# Altium project SCB.PrjPCB (part 1 of 6)
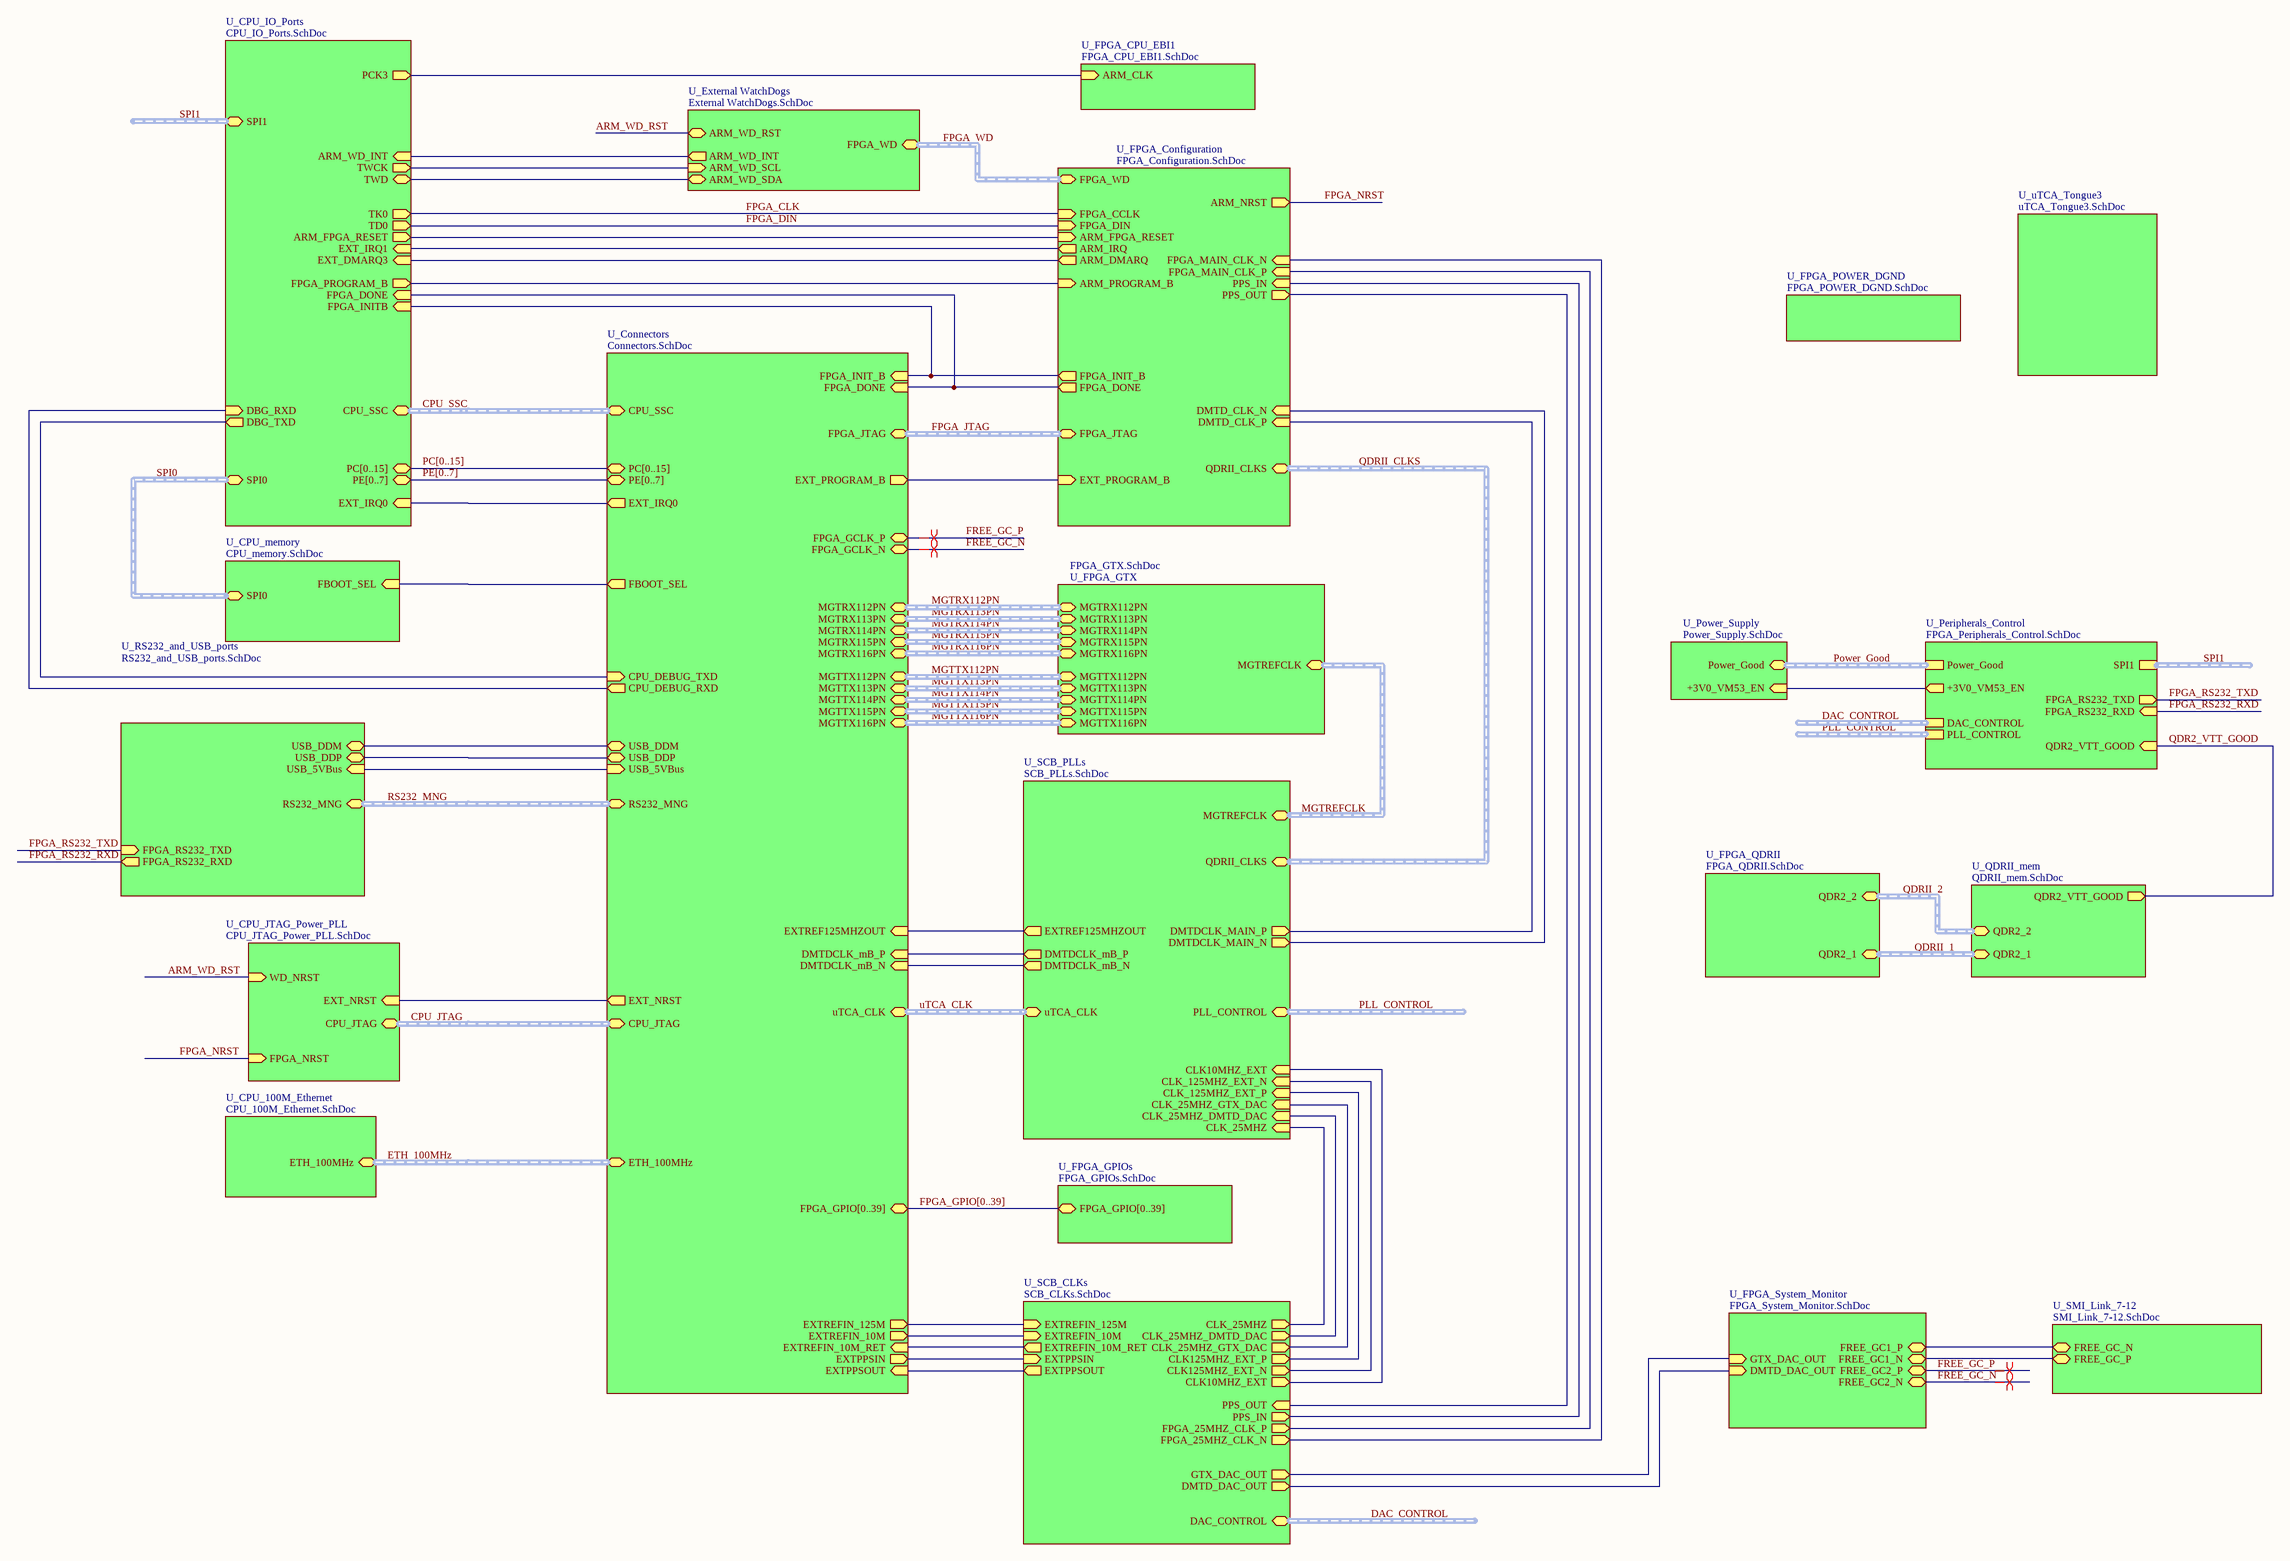
[diagram p0: SCB_MAIN.SchDoc]
23 sheets, 784 parts. Net scope: hierarchical (ports join the sheet entries above them; power ports are global).
Board file: uTCA_MCH_PCB3.pcbdoc
Sheets:
  SCB_MAIN.SchDoc
    U_Connectors = Connectors.SchDoc
    U_CPU_JTAG_Power_PLL = CPU_JTAG_Power_PLL.SchDoc
    U_RS232_and_USB_ports = RS232_and_USB_ports.SchDoc
    U_SCB_CLKs = SCB_CLKs.SchDoc
    U_FPGA_CPU_EBI1 = FPGA_CPU_EBI1.SchDoc
    U_FPGA_GTX = FPGA_GTX.SchDoc
    U_CPU_100M_Ethernet = CPU_100M_Ethernet.SchDoc
    U_CPU_memory = CPU_Memory.SchDoc
    U_SMI_Link_7-12 = SMI_Link_7-12.SchDoc
    U_uTCA_Tongue3 = uTCA_Tongue3.SchDoc
    U_External WatchDogs = External WatchDogs.SchDoc
    U_FPGA_Configuration = FPGA_Configuration.SchDoc
    U_CPU_IO_Ports = CPU_IO_Ports.SchDoc
    U_SCB_PLLs = SCB_PLLs.SchDoc
    U_FPGA_GPIOs = FPGA_GPIOs.SchDoc
    U_FPGA_System_Monitor = FPGA_System_Monitor.SchDoc
    U_Power_Supply = Power_Supply.SchDoc
    U_FPGA_POWER_DGND = FPGA_POWER_DGND.SchDoc
    U_QDRII_mem = QDRII_mem.SchDoc
      U_QDRII_power = QDRII_power.SchDoc
    U_FPGA_QDRII = FPGA_QDRII.SchDoc
    U_Peripherals_Control = FPGA_Peripherals_Control.SchDoc

## Sheet SCB_MAIN.SchDoc
size A2

### Sub-sheets
U_Connectors = Connectors.SchDoc: USB_DDM (bidir), USB_DDP (bidir), USB_5VBus (in), CPU_DEBUG_TXD (in), CPU_DEBUG_RXD (out), EXTPPSIN (out), EXTREFIN_10M (out), EXTREFIN_125M (out), EXTPPSOUT (in), EXTREF125MHZOUT (in), FBOOT_SEL (out), EXT_IRQ0 (out), EXT_NRST (out), FPGA_GCLK_P (bidir), EXT_PROGRAM_B (out), FPGA_DONE (in), FPGA_INIT_B (in), PC[0..15] (bidir), PE[0..7] (bidir), FPGA_GPIO[0..39] (bidir), DMTDCLK_mB_P (in), DMTDCLK_mB_N (in), FPGA_GCLK_N (bidir), MGTTX112PN (harness MGTTX112PN), MGTTX113PN (harness MGTTX113PN), MGTTX114PN (harness MGTTX114PN), MGTTX115PN (harness MGTTX115PN), MGTTX116PN (harness MGTTX116PN), MGTRX112PN (harness MGTRX112PN), MGTRX113PN (harness MGTRX113PN), MGTRX114PN (harness MGTRX114PN), MGTRX115PN (harness MGTRX115PN), MGTRX116PN (harness MGTRX116PN), ETH_100MHz (harness ETH_100MHz), uTCA_CLK (harness uTCA_CLK), CPU_JTAG (harness CPU_JTAG), FPGA_JTAG (harness FPGA_JTAG), CPU_SSC (harness CPU_SSC), RS232_MNG (harness RS232_MNG), EXTREFIN_10M_RET (in)
U_CPU_100M_Ethernet = CPU_100M_Ethernet.SchDoc: ETH_100MHz (harness ETH_100MHz)
U_CPU_IO_Ports = CPU_IO_Ports.SchDoc: EXT_DMARQ3 (in), DBG_TXD (out), DBG_RXD (in), TK0 (out), TD0 (out), PE[0..7] (bidir), PC[0..15] (bidir), EXT_IRQ1 (in), EXT_IRQ0 (in), PCK3 (out), FPGA_DONE (in), FPGA_INITB (in), TWD (bidir), TWCK (out), ARM_WD_INT (in), FPGA_PROGRAM_B (out), CPU_SSC (harness CPU_SSC), SPI0 (harness SPI0), SPI1 (harness SPI1), ARM_FPGA_RESET (out)
U_CPU_JTAG_Power_PLL = CPU_JTAG_Power_PLL.SchDoc: EXT_NRST (in), WD_NRST (in), FPGA_NRST (in), CPU_JTAG (harness CPU_JTAG)
U_CPU_memory = CPU_memory.SchDoc: FBOOT_SEL (in), SPI0 (harness SPI0)
U_External WatchDogs = External WatchDogs.SchDoc: ARM_WD_SCL (in), ARM_WD_SDA (bidir), ARM_WD_INT (out), ARM_WD_RST (bidir), FPGA_WD (harness FPGA_WD)
U_FPGA_Configuration = FPGA_Configuration.SchDoc: FPGA_DONE (out), FPGA_INIT_B (out), ARM_PROGRAM_B (in), FPGA_CCLK (in), FPGA_DIN (in), EXT_PROGRAM_B (in), ARM_NRST (out), ARM_DMARQ (out), ARM_IRQ (out), DMTD_CLK_P (in), DMTD_CLK_N (in), PPS_IN (in), PPS_OUT (out), FPGA_MAIN_CLK_P (in), FPGA_MAIN_CLK_N (in), QDRII_CLKS (harness QDRII_CLKS), FPGA_JTAG (harness FPGA_JTAG), FPGA_WD (harness FPGA_WD), ARM_FPGA_RESET (in)
U_FPGA_CPU_EBI1 = FPGA_CPU_EBI1.SchDoc: ARM_CLK (in)
U_FPGA_GPIOs = FPGA_GPIOs.SchDoc: FPGA_GPIO[0..39] (bidir)
U_FPGA_GTX = FPGA_GTX.SchDoc: MGTREFCLK (harness MGTREFCLK), MGTRX116PN (harness MGTRX116PN), MGTRX115PN (harness MGTRX115PN), MGTRX114PN (harness MGTRX114PN), MGTRX113PN (harness MGTRX113PN), MGTRX112PN (harness MGTRX112PN), MGTTX112PN (harness MGTTX112PN), MGTTX113PN (harness MGTTX113PN), MGTTX114PN (harness MGTTX114PN), MGTTX115PN (harness MGTTX115PN), MGTTX116PN (harness MGTTX116PN)
U_FPGA_POWER_DGND = FPGA_POWER_DGND.SchDoc: no entries
U_FPGA_QDRII = FPGA_QDRII.SchDoc: QDR2_2 (harness qdr2_2_bus), QDR2_1 (harness qdr2_1_bus)
U_FPGA_System_Monitor = FPGA_System_Monitor.SchDoc: DMTD_DAC_OUT (in), GTX_DAC_OUT (in), FREE_GC1_P (bidir), FREE_GC1_N (bidir), FREE_GC2_P (bidir), FREE_GC2_N (bidir)
U_Peripherals_Control = FPGA_Peripherals_Control.SchDoc: SPI1 (harness SPI1), Power_Good (harness Power-Good), DAC_CONTROL (harness DAC_CONTROL), PLL_CONTROL (harness PLL_CONTROL), QDR2_VTT_GOOD (in), +3V0_VM53_EN (out), FPGA_RS232_TXD (out), FPGA_RS232_RXD (in)
U_Power_Supply = Power_Supply.SchDoc: Power_Good (harness Power-Good), +3V0_VM53_EN (in)
U_QDRII_mem = QDRII_mem.SchDoc: QDR2_VTT_GOOD (out), QDR2_1 (harness qdr2_1_bus), QDR2_2 (harness qdr2_2_bus)
U_RS232_and_USB_ports = RS232_and_USB_ports.SchDoc: USB_DDM (bidir), USB_DDP (bidir), USB_5VBus (in), FPGA_RS232_TXD (in), FPGA_RS232_RXD (out), RS232_MNG (harness RS232_MNG)
U_SCB_CLKs = SCB_CLKs.SchDoc: EXTREFIN_10M (in), CLK10MHZ_EXT (out), CLK_25MHZ_GTX_DAC (out), CLK_25MHZ_DMTD_DAC (out), EXTPPSIN (in), EXTPPSOUT (out), EXTREFIN_125M (in), CLK125MHZ_EXT_P (out), CLK125MHZ_EXT_N (out), CLK_25MHZ (out), FPGA_25MHZ_CLK_P (out), FPGA_25MHZ_CLK_N (out), DMTD_DAC_OUT (out), GTX_DAC_OUT (out), PPS_IN (out), PPS_OUT (in), DAC_CONTROL (harness DAC_CONTROL), EXTREFIN_10M_RET (out)
U_SCB_PLLs = SCB_PLLs.SchDoc: CLK_125MHZ_EXT_P (in), CLK_125MHZ_EXT_N (in), CLK_25MHZ_GTX_DAC (in), CLK10MHZ_EXT (in), DMTDCLK_MAIN_P (out), DMTDCLK_MAIN_N (out), CLK_25MHZ_DMTD_DAC (in), EXTREF125MHZOUT (out), CLK_25MHZ (in), DMTDCLK_mB_P (out), DMTDCLK_mB_N (out), PLL_CONTROL (harness PLL_CONTROL), QDRII_CLKS (harness QDRII_CLKS), MGTREFCLK (harness MGTREFCLK), uTCA_CLK (harness uTCA_CLK)
U_SMI_Link_7-12 = SMI_Link_7-12.SchDoc: FREE_GC_P (bidir), FREE_GC_N (bidir)
U_uTCA_Tongue3 = uTCA_Tongue3.SchDoc: no entries

### Nets
+3V0_VM53_EN: sheet U_Power_Supply/+3V0_VM53_EN, sheet U_Peripherals_Control/+3V0_VM53_EN
ARM_DMARQ: sheet U_FPGA_Configuration/ARM_DMARQ, sheet U_CPU_IO_Ports/EXT_DMARQ3
ARM_FPGA_RESET: sheet U_FPGA_Configuration/ARM_FPGA_RESET, sheet U_CPU_IO_Ports/ARM_FPGA_RESET
ARM_IRQ: sheet U_FPGA_Configuration/ARM_IRQ, sheet U_CPU_IO_Ports/EXT_IRQ1
ARM_PROGRAM_B: sheet U_FPGA_Configuration/ARM_PROGRAM_B, sheet U_CPU_IO_Ports/FPGA_PROGRAM_B
ARM_WD_RST: sheet U_CPU_JTAG_Power_PLL/WD_NRST, sheet U_External WatchDogs/ARM_WD_RST
CLK125MHZ_EXT_N: sheet U_SCB_CLKs/CLK125MHZ_EXT_N, sheet U_SCB_PLLs/CLK_125MHZ_EXT_N
CLK125MHZ_EXT_P: sheet U_SCB_CLKs/CLK125MHZ_EXT_P, sheet U_SCB_PLLs/CLK_125MHZ_EXT_P
CLK_25MHz: sheet U_SCB_CLKs/CLK_25MHZ, sheet U_SCB_PLLs/CLK_25MHZ
DMTD_CLK_N: sheet U_FPGA_Configuration/DMTD_CLK_N, sheet U_SCB_PLLs/DMTDCLK_MAIN_N
DMTD_CLK_P: sheet U_FPGA_Configuration/DMTD_CLK_P, sheet U_SCB_PLLs/DMTDCLK_MAIN_P
DMTDCLK_mB_N: sheet U_Connectors/DMTDCLK_mB_N, sheet U_SCB_PLLs/DMTDCLK_mB_N
DMTDCLK_mB_P: sheet U_Connectors/DMTDCLK_mB_P, sheet U_SCB_PLLs/DMTDCLK_mB_P
EXT_PROGRAM_B: sheet U_Connectors/EXT_PROGRAM_B, sheet U_FPGA_Configuration/EXT_PROGRAM_B
FPGA_25MHZ_CLK_N: sheet U_SCB_CLKs/FPGA_25MHZ_CLK_N, sheet U_FPGA_Configuration/FPGA_MAIN_CLK_N
FPGA_25MHZ_CLK_P: sheet U_SCB_CLKs/FPGA_25MHZ_CLK_P, sheet U_FPGA_Configuration/FPGA_MAIN_CLK_P
FPGA_CLK: sheet U_FPGA_Configuration/FPGA_CCLK, sheet U_CPU_IO_Ports/TK0  [project net FPGA_CCLK]
FPGA_DIN: sheet U_FPGA_Configuration/FPGA_DIN, sheet U_CPU_IO_Ports/TD0
FPGA_DONE: sheet U_Connectors/FPGA_DONE, sheet U_FPGA_Configuration/FPGA_DONE, sheet U_CPU_IO_Ports/FPGA_DONE
FPGA_INIT_B: sheet U_Connectors/FPGA_INIT_B, sheet U_FPGA_Configuration/FPGA_INIT_B, sheet U_CPU_IO_Ports/FPGA_INITB
FPGA_NRST: sheet U_CPU_JTAG_Power_PLL/FPGA_NRST, sheet U_FPGA_Configuration/ARM_NRST  [project net ARM_NRST]
FPGA_RS232_RXD: sheet U_RS232_and_USB_ports/FPGA_RS232_RXD, sheet U_Peripherals_Control/FPGA_RS232_RXD
FPGA_RS232_TXD: sheet U_RS232_and_USB_ports/FPGA_RS232_TXD, sheet U_Peripherals_Control/FPGA_RS232_TXD
FREE_GC1_N: sheet U_SMI_Link_7-12/FREE_GC_P, sheet U_FPGA_System_Monitor/FREE_GC1_N
FREE_GC1_P: sheet U_SMI_Link_7-12/FREE_GC_N, sheet U_FPGA_System_Monitor/FREE_GC1_P
FREE_GC_N: sheet U_Connectors/FPGA_GCLK_N, sheet U_FPGA_System_Monitor/FREE_GC2_N  [project net FPGA_GCLK_N]
FREE_GC_P: sheet U_Connectors/FPGA_GCLK_P, sheet U_FPGA_System_Monitor/FREE_GC2_P  [project net FPGA_GCLK_P]
PCK3: sheet U_FPGA_CPU_EBI1/ARM_CLK, sheet U_CPU_IO_Ports/PCK3
PPS_OUT: sheet U_SCB_CLKs/PPS_OUT, sheet U_FPGA_Configuration/PPS_OUT
QDR2_VTT_GOOD: sheet U_QDRII_mem/QDR2_VTT_GOOD, sheet U_Peripherals_Control/QDR2_VTT_GOOD
REF_10M: sheet U_SCB_CLKs/CLK10MHZ_EXT, sheet U_SCB_PLLs/CLK10MHZ_EXT
USB_5VBus: sheet U_Connectors/USB_5VBus, sheet U_RS232_and_USB_ports/USB_5VBus
USB_DDM: sheet U_Connectors/USB_DDM, sheet U_RS232_and_USB_ports/USB_DDM
USB_DDP: sheet U_Connectors/USB_DDP, sheet U_RS232_and_USB_ports/USB_DDP
NetC46_1: sheet U_Connectors/EXTREFIN_125M, sheet U_SCB_CLKs/EXTREFIN_125M
NetC154_2: sheet U_SCB_CLKs/CLK_25MHZ_DMTD_DAC, sheet U_SCB_PLLs/CLK_25MHZ_DMTD_DAC
NetC185_1: sheet U_SCB_CLKs/CLK_25MHZ_GTX_DAC, sheet U_SCB_PLLs/CLK_25MHZ_GTX_DAC
NetD5_2: sheet U_Connectors/EXT_NRST, sheet U_CPU_JTAG_Power_PLL/EXT_NRST
NetIC1#1_A11: sheet U_Connectors/CPU_DEBUG_RXD, sheet U_CPU_IO_Ports/DBG_RXD
NetIC1#1_E10: sheet U_Connectors/CPU_DEBUG_TXD, sheet U_CPU_IO_Ports/DBG_TXD
NetIC1#1_H12: sheet U_External WatchDogs/ARM_WD_INT, sheet U_CPU_IO_Ports/ARM_WD_INT
NetIC1#1_J15: sheet U_External WatchDogs/ARM_WD_SCL, sheet U_CPU_IO_Ports/TWCK
NetIC1#1_K14: sheet U_Connectors/EXT_IRQ0, sheet U_CPU_IO_Ports/EXT_IRQ0
NetIC1#1_L14: sheet U_External WatchDogs/ARM_WD_SDA, sheet U_CPU_IO_Ports/TWD
NetIC5_3: sheet U_SCB_CLKs/GTX_DAC_OUT, sheet U_FPGA_System_Monitor/GTX_DAC_OUT
NetIC8_3: sheet U_SCB_CLKs/DMTD_DAC_OUT, sheet U_FPGA_System_Monitor/DMTD_DAC_OUT
NetIC12_2: sheet U_Connectors/EXTPPSIN, sheet U_SCB_CLKs/EXTPPSIN
NetIC26_1: sheet U_Connectors/FBOOT_SEL, sheet U_CPU_memory/FBOOT_SEL
NetIC33_J25: sheet U_SCB_CLKs/PPS_IN, sheet U_FPGA_Configuration/PPS_IN
NetP1_1: sheet U_Connectors/EXTREF125MHZOUT, sheet U_SCB_PLLs/EXTREF125MHZOUT
NetP3_1: sheet U_Connectors/EXTPPSOUT, sheet U_SCB_CLKs/EXTPPSOUT
NetP7_1: sheet U_Connectors/EXTREFIN_10M, sheet U_SCB_CLKs/EXTREFIN_10M
NetP7_2: sheet U_Connectors/EXTREFIN_10M_RET, sheet U_SCB_CLKs/EXTREFIN_10M_RET

### Buses and harness runs
bus FPGA_GPIO[0..39] = sheet U_Connectors/FPGA_GPIO[0..39] = sheet U_FPGA_GPIOs/FPGA_GPIO[0..39]
bus PC[0..15] = sheet U_Connectors/PC[0..15] = sheet U_CPU_IO_Ports/PC[0..15]
bus PE[0..7] = sheet U_Connectors/PE[0..7] = sheet U_CPU_IO_Ports/PE[0..7]
harness CPU_JTAG = sheet U_Connectors/CPU_JTAG = sheet U_CPU_JTAG_Power_PLL/CPU_JTAG
harness CPU_SSC = sheet U_Connectors/CPU_SSC = sheet U_CPU_IO_Ports/CPU_SSC
harness DAC_CONTROL = sheet U_Peripherals_Control/DAC_CONTROL
harness DAC_CONTROL = sheet U_SCB_CLKs/DAC_CONTROL
harness ETH_100MHz = sheet U_Connectors/ETH_100MHz = sheet U_CPU_100M_Ethernet/ETH_100MHz
harness FPGA_JTAG = sheet U_Connectors/FPGA_JTAG = sheet U_FPGA_Configuration/FPGA_JTAG
harness FPGA_WD = sheet U_External WatchDogs/FPGA_WD = sheet U_FPGA_Configuration/FPGA_WD
harness MGTREFCLK = sheet U_FPGA_GTX/MGTREFCLK = sheet U_SCB_PLLs/MGTREFCLK
harness MGTRX112PN = sheet U_Connectors/MGTRX112PN = sheet U_FPGA_GTX/MGTRX112PN
harness MGTRX113PN = sheet U_Connectors/MGTRX113PN = sheet U_FPGA_GTX/MGTRX113PN
harness MGTRX114PN = sheet U_Connectors/MGTRX114PN = sheet U_FPGA_GTX/MGTRX114PN
harness MGTRX115PN = sheet U_Connectors/MGTRX115PN = sheet U_FPGA_GTX/MGTRX115PN
harness MGTRX116PN = sheet U_Connectors/MGTRX116PN = sheet U_FPGA_GTX/MGTRX116PN
harness MGTTX112PN = sheet U_Connectors/MGTTX112PN = sheet U_FPGA_GTX/MGTTX112PN
harness MGTTX113PN = sheet U_Connectors/MGTTX113PN = sheet U_FPGA_GTX/MGTTX113PN
harness MGTTX114PN = sheet U_Connectors/MGTTX114PN = sheet U_FPGA_GTX/MGTTX114PN
harness MGTTX115PN = sheet U_Connectors/MGTTX115PN = sheet U_FPGA_GTX/MGTTX115PN
harness MGTTX116PN = sheet U_Connectors/MGTTX116PN = sheet U_FPGA_GTX/MGTTX116PN
harness PLL_CONTROL = sheet U_Peripherals_Control/PLL_CONTROL
harness PLL_CONTROL = sheet U_SCB_PLLs/PLL_CONTROL
harness Power_Good = sheet U_Peripherals_Control/Power_Good = sheet U_Power_Supply/Power_Good
harness QDRII_1 = sheet U_FPGA_QDRII/QDR2_1 = sheet U_QDRII_mem/QDR2_1
harness QDRII_2 = sheet U_FPGA_QDRII/QDR2_2 = sheet U_QDRII_mem/QDR2_2
harness QDRII_CLKS = sheet U_FPGA_Configuration/QDRII_CLKS = sheet U_SCB_PLLs/QDRII_CLKS
harness RS232_MNG = sheet U_Connectors/RS232_MNG = sheet U_RS232_and_USB_ports/RS232_MNG
harness SPI0 = sheet U_CPU_IO_Ports/SPI0 = sheet U_CPU_memory/SPI0
harness SPI1 = sheet U_CPU_IO_Ports/SPI1
harness SPI1 = sheet U_Peripherals_Control/SPI1
harness uTCA_CLK = sheet U_Connectors/uTCA_CLK = sheet U_SCB_PLLs/uTCA_CLK

### Layout directives
differential pair: FPGA_GCLK_N, FPGA_GCLK_P

## Sheet Connectors.SchDoc
size A3
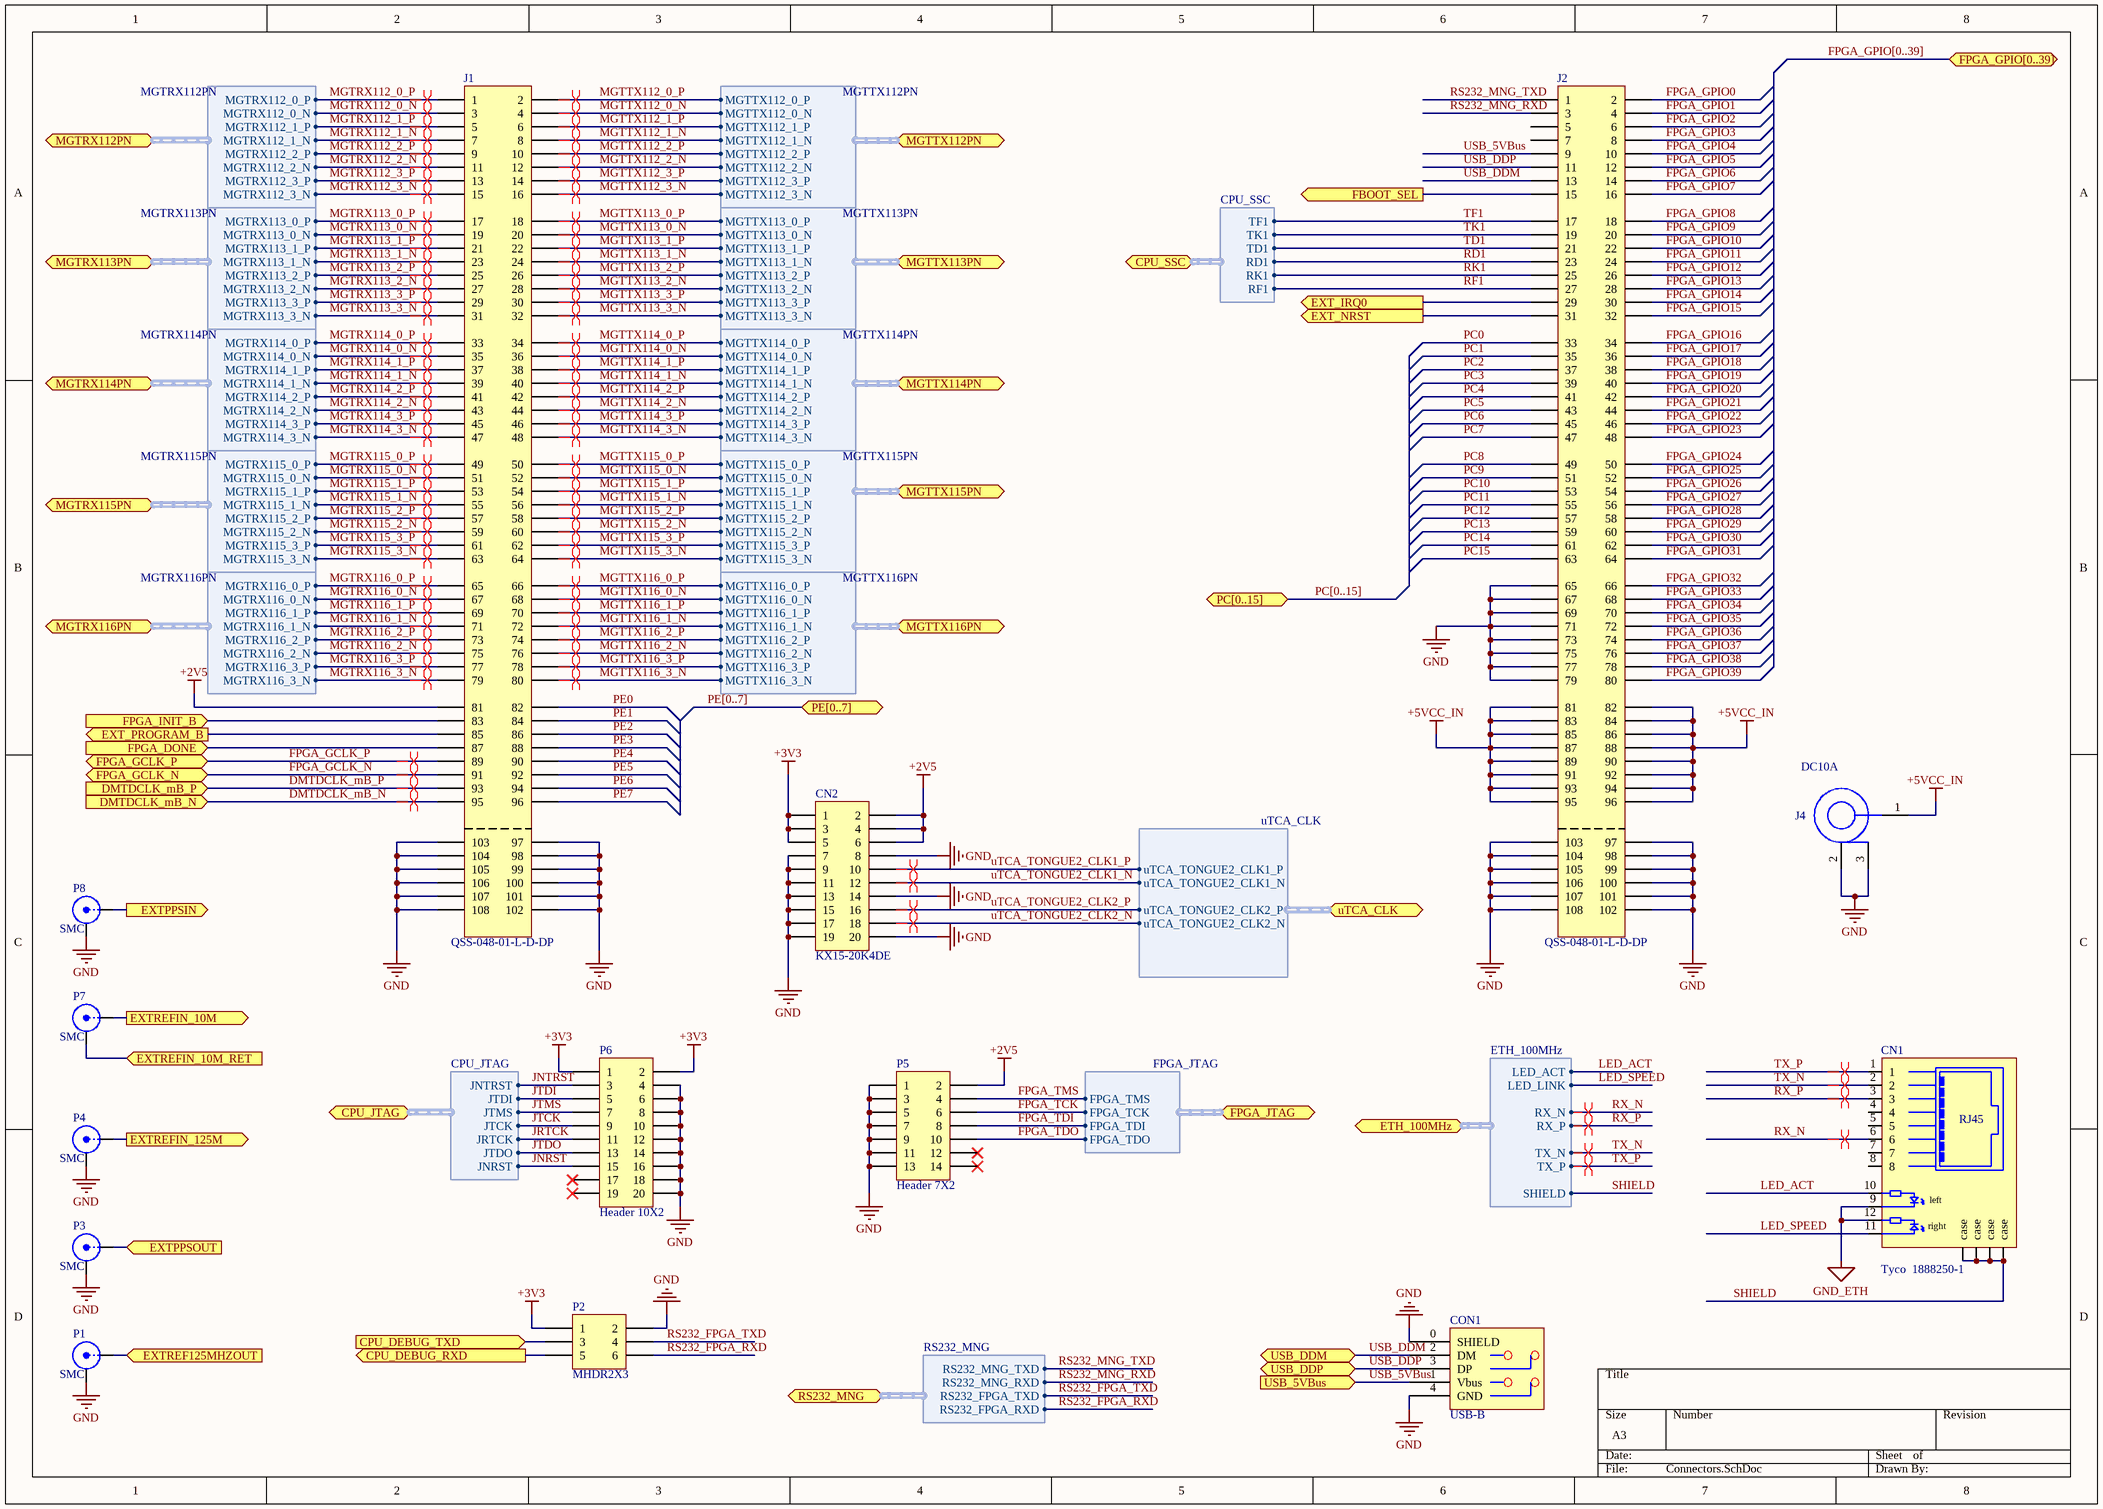
[diagram p1: Connectors.SchDoc]

### Parts
CN1  Tyco  1888250-1  [TYCO_ETHERNET_1888250-1]
CN2  KX15-20K4DE  [JAE_KX15_20P]
CON1  USB-B  [USBB-G]
J1  QSS-048-01-L-D-DP  [QSS-048-01-X-D-DP-A]
J2  QSS-048-01-L-D-DP  [QSS-048-01-X-D-DP-A]
J4  DC10A  [dc-10]
P1  SMC  [SMB_V-RJ45]
P2  MHDR2X3  [HDR2X3]
P3  SMC  [SMB_V-RJ45]
P4  SMC  [SMB_V-RJ45]
P5  Header 7X2  [CONN_HDR_SMD_2mm_2x7]
P6  Header 10X2  [HDR2X10]
P7  SMC  [SMB_V-RJ45]
P8  SMC  [SMB_V-RJ45]

### Ports
CPU_DEBUG_RXD (out), CPU_DEBUG_TXD (in), CPU_JTAG (harness CPU_JTAG), CPU_SSC (harness CPU_SSC), DMTDCLK_mB_N (in), DMTDCLK_mB_P (in), ETH_100MHz (harness ETH_100MHz), EXT_IRQ0 (out), EXT_NRST (out), EXT_PROGRAM_B (out), EXTPPSIN (out), EXTPPSOUT (in), EXTREF125MHZOUT (in), EXTREFIN_10M (out), EXTREFIN_10M_RET (in), EXTREFIN_125M (out), FBOOT_SEL (out), FPGA_DONE (in), FPGA_GCLK_N (bidir), FPGA_GCLK_P (bidir), FPGA_GPIO[0..39] (bidir), FPGA_INIT_B (in), FPGA_JTAG (harness FPGA_JTAG), MGTRX112PN (harness MGTRX112PN), MGTRX113PN (harness MGTRX113PN), MGTRX114PN (harness MGTRX114PN), MGTRX115PN (harness MGTRX115PN), MGTRX116PN (harness MGTRX116PN), MGTTX112PN (harness MGTTX112PN), MGTTX113PN (harness MGTTX113PN), MGTTX114PN (harness MGTTX114PN), MGTTX115PN (harness MGTTX115PN), MGTTX116PN (harness MGTTX116PN), PC[0..15] (bidir), PE[0..7] (bidir), RS232_MNG (harness RS232_MNG), USB_5VBus (in), USB_DDM (bidir), USB_DDP (bidir), uTCA_CLK (harness uTCA_CLK)

### Harnesses
MGTTX112PN: MGTTX112_0_P, MGTTX112_0_N, MGTTX112_1_P, MGTTX112_1_N, MGTTX112_2_P, MGTTX112_2_N, MGTTX112_3_P, MGTTX112_3_N
MGTTX113PN: MGTTX113_0_P, MGTTX113_0_N, MGTTX113_1_P, MGTTX113_1_N, MGTTX113_2_P, MGTTX113_2_N, MGTTX113_3_P, MGTTX113_3_N
MGTTX114PN: MGTTX114_0_P, MGTTX114_0_N, MGTTX114_1_P, MGTTX114_1_N, MGTTX114_2_P, MGTTX114_2_N, MGTTX114_3_P, MGTTX114_3_N
MGTTX115PN: MGTTX115_0_P, MGTTX115_0_N, MGTTX115_1_P, MGTTX115_1_N, MGTTX115_2_P, MGTTX115_2_N, MGTTX115_3_P, MGTTX115_3_N
MGTTX116PN: MGTTX116_0_P, MGTTX116_0_N, MGTTX116_1_P, MGTTX116_1_N, MGTTX116_2_P, MGTTX116_2_N, MGTTX116_3_P, MGTTX116_3_N
MGTRX112PN: MGTRX112_0_P, MGTRX112_0_N, MGTRX112_1_P, MGTRX112_1_N, MGTRX112_2_P, MGTRX112_2_N, MGTRX112_3_P, MGTRX112_3_N
MGTRX113PN: MGTRX113_0_P, MGTRX113_0_N, MGTRX113_1_P, MGTRX113_1_N, MGTRX113_2_P, MGTRX113_2_N, MGTRX113_3_P, MGTRX113_3_N
MGTRX114PN: MGTRX114_0_P, MGTRX114_0_N, MGTRX114_1_P, MGTRX114_1_N, MGTRX114_2_P, MGTRX114_2_N, MGTRX114_3_P, MGTRX114_3_N
MGTRX115PN: MGTRX115_0_P, MGTRX115_0_N, MGTRX115_1_P, MGTRX115_1_N, MGTRX115_2_P, MGTRX115_2_N, MGTRX115_3_P, MGTRX115_3_N
MGTRX116PN: MGTRX116_0_P, MGTRX116_0_N, MGTRX116_1_P, MGTRX116_1_N, MGTRX116_2_P, MGTRX116_2_N, MGTRX116_3_P, MGTRX116_3_N
ETH_100MHz: SHIELD, RX_P, TX_P, TX_N, RX_N, LED_LINK, LED_ACT
uTCA_CLK: uTCA_TONGUE2_CLK1_P, uTCA_TONGUE2_CLK1_N, uTCA_TONGUE2_CLK2_P, uTCA_TONGUE2_CLK2_N
CPU_JTAG: JNRST, JTDO, JRTCK, JTCK, JTMS, JTDI, JNTRST
FPGA_JTAG: FPGA_TMS, FPGA_TCK, FPGA_TDI, FPGA_TDO
CPU_SSC: TF1, TK1, TD1, RD1, RK1, RF1
RS232_MNG: RS232_MNG_TXD, RS232_FPGA_TXD, RS232_MNG_RXD, RS232_FPGA_RXD

### Nets
+2V5: CN2.2 CN2.4 CN2.6 J1.81 P5.2
+3V3: CN2.1 CN2.3 CN2.5 P2.1 P6.1 P6.2
+5VCC_IN: J2.81 J2.82 J2.83 J2.84 J2.85 J2.86 J2.87 J2.88 J2.89 J2.90 J2.91 J2.92 J2.93 J2.94 J2.95 J2.96 J4.1(P1)
GND: CN2.7 CN2.8 CN2.9 CN2.11 CN2.13 CN2.14 CN2.15 CN2.17 CN2.19 CN2.20 CON1.0(SHIELD) CON1.4(GND) J1.97 J1.98 J1.99 J1.100 J1.101 J1.102 J1.103 J1.104 J1.105 J1.106 J1.107 J1.108 J2.65 J2.67 J2.69 J2.71 J2.73 J2.75 J2.77 J2.79 J2.97 J2.98 J2.99 J2.100 J2.101 J2.102 J2.103 J2.104 J2.105 J2.106 J2.107 J2.108 J4.2(P2) J4.3(P3) P1.2(Y) P2.2 P3.2(Y) P4.2(Y) P5.1 P5.3 P5.5 P5.7 P5.9 P5.11 P5.13 P6.4 P6.6 P6.8 P6.10 P6.12 P6.14 P6.16 P6.18 P6.20 P8.2(Y)
GND_ETH: CN1.9(D2) CN1.12(D3)
DMTDCLK_mB_N: J1.95 ; port DMTDCLK_mB_N
DMTDCLK_mB_P: J1.93 ; port DMTDCLK_mB_P
EXT_PROGRAM_B: J1.85 ; port EXT_PROGRAM_B
FPGA_DONE: J1.87 ; port FPGA_DONE
FPGA_GCLK_N: J1.91 ; port FPGA_GCLK_N
FPGA_GCLK_P: J1.89 ; port FPGA_GCLK_P
FPGA_GPIO0: J2.2
FPGA_GPIO1: J2.4
FPGA_GPIO2: J2.6
FPGA_GPIO3: J2.8
FPGA_GPIO4: J2.10
FPGA_GPIO5: J2.12
FPGA_GPIO6: J2.14
FPGA_GPIO7: J2.16
FPGA_GPIO8: J2.18
FPGA_GPIO9: J2.20
FPGA_GPIO10: J2.22
FPGA_GPIO11: J2.24
FPGA_GPIO12: J2.26
FPGA_GPIO13: J2.28
FPGA_GPIO14: J2.30
FPGA_GPIO15: J2.32
FPGA_GPIO16: J2.34
FPGA_GPIO17: J2.36
FPGA_GPIO18: J2.38
FPGA_GPIO19: J2.40
FPGA_GPIO20: J2.42
FPGA_GPIO21: J2.44
FPGA_GPIO22: J2.46
FPGA_GPIO23: J2.48
FPGA_GPIO24: J2.50
FPGA_GPIO25: J2.52
FPGA_GPIO26: J2.54
FPGA_GPIO27: J2.56
FPGA_GPIO28: J2.58
FPGA_GPIO29: J2.60
FPGA_GPIO30: J2.62
FPGA_GPIO31: J2.64
FPGA_GPIO32: J2.66
FPGA_GPIO33: J2.68
FPGA_GPIO34: J2.70
FPGA_GPIO35: J2.72
FPGA_GPIO36: J2.74
FPGA_GPIO37: J2.76
FPGA_GPIO38: J2.78
FPGA_GPIO39: J2.80
FPGA_INIT_B: J1.83 ; port FPGA_INIT_B
FPGA_TCK: P5.6 ; port FPGA_JTAG.FPGA_TCK  [project net FPGA_JTAG.FPGA_TCK]
FPGA_TDI: P5.8 ; port FPGA_JTAG.FPGA_TDI  [project net FPGA_JTAG.FPGA_TDI]
FPGA_TDO: P5.10 ; port FPGA_JTAG.FPGA_TDO  [project net FPGA_JTAG.FPGA_TDO]
FPGA_TMS: P5.4 ; port FPGA_JTAG.FPGA_TMS  [project net FPGA_JTAG.FPGA_TMS]
JNRST: P6.15 ; port CPU_JTAG.JNRST  [project net CPU_JTAG.JNRST]
JNTRST: P6.3 ; port CPU_JTAG.JNTRST  [project net CPU_JTAG.JNTRST]
JRTCK: P6.11 ; port CPU_JTAG.JRTCK  [project net CPU_JTAG.JRTCK]
JTCK: P6.9 ; port CPU_JTAG.JTCK  [project net CPU_JTAG.JTCK]
JTDI: P6.5 ; port CPU_JTAG.JTDI  [project net CPU_JTAG.JTDI]
JTDO: P6.13 ; port CPU_JTAG.JTDO  [project net CPU_JTAG.JTDO]
JTMS: P6.7 ; port CPU_JTAG.JTMS  [project net CPU_JTAG.JTMS]
LED_ACT: CN1.10(D1) ; port ETH_100MHz.LED_ACT  [project net ETH_100MHz.LED_ACT]
LED_SPEED: CN1.11(D4) ; port ETH_100MHz.LED_LINK  [project net ETH_100MHz.LED_LINK]
MGTRX112_0_N: J1.3 ; port MGTRX112PN.MGTRX112_0_N
MGTRX112_0_P: J1.1 ; port MGTRX112PN.MGTRX112_0_P
MGTRX112_1_N: J1.7 ; port MGTRX112PN.MGTRX112_1_N
MGTRX112_1_P: J1.5 ; port MGTRX112PN.MGTRX112_1_P
MGTRX112_2_N: J1.11 ; port MGTRX112PN.MGTRX112_2_N
MGTRX112_2_P: J1.9 ; port MGTRX112PN.MGTRX112_2_P
MGTRX112_3_N: J1.15 ; port MGTRX112PN.MGTRX112_3_N
MGTRX112_3_P: J1.13 ; port MGTRX112PN.MGTRX112_3_P
MGTRX113_0_N: J1.19 ; port MGTRX113PN.MGTRX113_0_N
MGTRX113_0_P: J1.17 ; port MGTRX113PN.MGTRX113_0_P
MGTRX113_1_N: J1.23 ; port MGTRX113PN.MGTRX113_1_N
MGTRX113_1_P: J1.21 ; port MGTRX113PN.MGTRX113_1_P
MGTRX113_2_N: J1.27 ; port MGTRX113PN.MGTRX113_2_N
MGTRX113_2_P: J1.25 ; port MGTRX113PN.MGTRX113_2_P
MGTRX113_3_N: J1.31 ; port MGTRX113PN.MGTRX113_3_N
MGTRX113_3_P: J1.29 ; port MGTRX113PN.MGTRX113_3_P
MGTRX114_0_N: J1.35 ; port MGTRX114PN.MGTRX114_0_N
MGTRX114_0_P: J1.33 ; port MGTRX114PN.MGTRX114_0_P
MGTRX114_1_N: J1.39 ; port MGTRX114PN.MGTRX114_1_N
MGTRX114_1_P: J1.37 ; port MGTRX114PN.MGTRX114_1_P
MGTRX114_2_N: J1.43 ; port MGTRX114PN.MGTRX114_2_N
MGTRX114_2_P: J1.41 ; port MGTRX114PN.MGTRX114_2_P
MGTRX114_3_N: J1.47 ; port MGTRX114PN.MGTRX114_3_N
MGTRX114_3_P: J1.45 ; port MGTRX114PN.MGTRX114_3_P
MGTRX115_0_N: J1.51 ; port MGTRX115PN.MGTRX115_0_N
MGTRX115_0_P: J1.49 ; port MGTRX115PN.MGTRX115_0_P
MGTRX115_1_N: J1.55 ; port MGTRX115PN.MGTRX115_1_N
MGTRX115_1_P: J1.53 ; port MGTRX115PN.MGTRX115_1_P
MGTRX115_2_N: J1.59 ; port MGTRX115PN.MGTRX115_2_N
MGTRX115_2_P: J1.57 ; port MGTRX115PN.MGTRX115_2_P
MGTRX115_3_N: J1.63 ; port MGTRX115PN.MGTRX115_3_N
MGTRX115_3_P: J1.61 ; port MGTRX115PN.MGTRX115_3_P
MGTRX116_0_N: J1.67 ; port MGTRX116PN.MGTRX116_0_N
MGTRX116_0_P: J1.65 ; port MGTRX116PN.MGTRX116_0_P
MGTRX116_1_N: J1.71 ; port MGTRX116PN.MGTRX116_1_N
MGTRX116_1_P: J1.69 ; port MGTRX116PN.MGTRX116_1_P
MGTRX116_2_N: J1.75 ; port MGTRX116PN.MGTRX116_2_N
MGTRX116_2_P: J1.73 ; port MGTRX116PN.MGTRX116_2_P
MGTRX116_3_N: J1.79 ; port MGTRX116PN.MGTRX116_3_N
MGTRX116_3_P: J1.77 ; port MGTRX116PN.MGTRX116_3_P
MGTTX112_0_N: J1.4 ; port MGTTX112PN.MGTTX112_0_N
MGTTX112_0_P: J1.2 ; port MGTTX112PN.MGTTX112_0_P
MGTTX112_1_N: J1.8 ; port MGTTX112PN.MGTTX112_1_N
MGTTX112_1_P: J1.6 ; port MGTTX112PN.MGTTX112_1_P
MGTTX112_2_N: J1.12 ; port MGTTX112PN.MGTTX112_2_N
MGTTX112_2_P: J1.10 ; port MGTTX112PN.MGTTX112_2_P
MGTTX112_3_N: J1.16 ; port MGTTX112PN.MGTTX112_3_N
MGTTX112_3_P: J1.14 ; port MGTTX112PN.MGTTX112_3_P
MGTTX113_0_N: J1.20 ; port MGTTX113PN.MGTTX113_0_N
MGTTX113_0_P: J1.18 ; port MGTTX113PN.MGTTX113_0_P
MGTTX113_1_N: J1.24 ; port MGTTX113PN.MGTTX113_1_N
MGTTX113_1_P: J1.22 ; port MGTTX113PN.MGTTX113_1_P
MGTTX113_2_N: J1.28 ; port MGTTX113PN.MGTTX113_2_N
MGTTX113_2_P: J1.26 ; port MGTTX113PN.MGTTX113_2_P
MGTTX113_3_N: J1.32 ; port MGTTX113PN.MGTTX113_3_N
MGTTX113_3_P: J1.30 ; port MGTTX113PN.MGTTX113_3_P
MGTTX114_0_N: J1.36 ; port MGTTX114PN.MGTTX114_0_N
MGTTX114_0_P: J1.34 ; port MGTTX114PN.MGTTX114_0_P
MGTTX114_1_N: J1.40 ; port MGTTX114PN.MGTTX114_1_N
MGTTX114_1_P: J1.38 ; port MGTTX114PN.MGTTX114_1_P
MGTTX114_2_N: J1.44 ; port MGTTX114PN.MGTTX114_2_N
MGTTX114_2_P: J1.42 ; port MGTTX114PN.MGTTX114_2_P
MGTTX114_3_N: J1.48 ; port MGTTX114PN.MGTTX114_3_N
MGTTX114_3_P: J1.46 ; port MGTTX114PN.MGTTX114_3_P
MGTTX115_0_N: J1.52 ; port MGTTX115PN.MGTTX115_0_N
MGTTX115_0_P: J1.50 ; port MGTTX115PN.MGTTX115_0_P
MGTTX115_1_N: J1.56 ; port MGTTX115PN.MGTTX115_1_N
MGTTX115_1_P: J1.54 ; port MGTTX115PN.MGTTX115_1_P
MGTTX115_2_N: J1.60 ; port MGTTX115PN.MGTTX115_2_N
MGTTX115_2_P: J1.58 ; port MGTTX115PN.MGTTX115_2_P
MGTTX115_3_N: J1.64 ; port MGTTX115PN.MGTTX115_3_N
MGTTX115_3_P: J1.62 ; port MGTTX115PN.MGTTX115_3_P
MGTTX116_0_N: J1.68 ; port MGTTX116PN.MGTTX116_0_N
MGTTX116_0_P: J1.66 ; port MGTTX116PN.MGTTX116_0_P
MGTTX116_1_N: J1.72 ; port MGTTX116PN.MGTTX116_1_N
MGTTX116_1_P: J1.70 ; port MGTTX116PN.MGTTX116_1_P
MGTTX116_2_N: J1.76 ; port MGTTX116PN.MGTTX116_2_N
MGTTX116_2_P: J1.74 ; port MGTTX116PN.MGTTX116_2_P
MGTTX116_3_N: J1.80 ; port MGTTX116PN.MGTTX116_3_N
MGTTX116_3_P: J1.78 ; port MGTTX116PN.MGTTX116_3_P
PC0: J2.33
PC1: J2.35
PC2: J2.37
PC3: J2.39
PC4: J2.41
PC5: J2.43
PC6: J2.45
PC7: J2.47
PC8: J2.49
PC9: J2.51
PC10: J2.53
PC11: J2.55
PC12: J2.57
PC13: J2.59
PC14: J2.61
PC15: J2.63
PE0: J1.82
PE1: J1.84
PE2: J1.86
PE3: J1.88
PE4: J1.90
PE5: J1.92
PE6: J1.94
PE7: J1.96
RD1: J2.23 ; port CPU_SSC.RD1  [project net CPU_SSC.RD1]
RF1: J2.27 ; port CPU_SSC.RF1  [project net CPU_SSC.RF1]
RK1: J2.25 ; port CPU_SSC.RK1  [project net CPU_SSC.RK1]
RS232_FPGA_RXD: P2.6 ; port RS232_MNG.RS232_FPGA_RXD
RS232_FPGA_TXD: P2.4 ; port RS232_MNG.RS232_FPGA_TXD
RS232_MNG_RXD: J2.3 ; port RS232_MNG.RS232_MNG_RXD  [project net RS232_MNG.RS232_MNG_RXD]
RS232_MNG_TXD: J2.1 ; port RS232_MNG.RS232_MNG_TXD  [project net RS232_MNG.RS232_MNG_TXD]
RX_N: CN1.6 ; port ETH_100MHz.RX_N  [project net ETH_100MHz.RX_N]
RX_P: CN1.3 ; port ETH_100MHz.RX_P  [project net ETH_100MHz.RX_P]
SHIELD: CN1.0(case) ; port ETH_100MHz.SHIELD  [project net ETH_100MHz.SHIELD]
TD1: J2.21 ; port CPU_SSC.TD1  [project net CPU_SSC.TD1]
TF1: J2.17 ; port CPU_SSC.TF1  [project net CPU_SSC.TF1]
TK1: J2.19 ; port CPU_SSC.TK1  [project net CPU_SSC.TK1]
TX_N: CN1.2 ; port ETH_100MHz.TX_N  [project net ETH_100MHz.TX_N]
TX_P: CN1.1 ; port ETH_100MHz.TX_P  [project net ETH_100MHz.TX_P]
USB_5VBus: CON1.1(Vbus) J2.9 ; port USB_5VBus
USB_DDM: CON1.2(DM) J2.13 ; port USB_DDM
USB_DDP: CON1.3(DP) J2.11 ; port USB_DDP
uTCA_TONGUE2_CLK1_N: CN2.12 ; port uTCA_CLK.uTCA_TONGUE2_CLK1_N  [project net uTCA_CLK.uTCA_TONGUE2_CLK1_N]
uTCA_TONGUE2_CLK1_P: CN2.10 ; port uTCA_CLK.uTCA_TONGUE2_CLK1_P  [project net uTCA_CLK.uTCA_TONGUE2_CLK1_P]
uTCA_TONGUE2_CLK2_N: CN2.18 ; port uTCA_CLK.uTCA_TONGUE2_CLK2_N  [project net uTCA_CLK.uTCA_TONGUE2_CLK2_N]
uTCA_TONGUE2_CLK2_P: CN2.16 ; port uTCA_CLK.uTCA_TONGUE2_CLK2_P  [project net uTCA_CLK.uTCA_TONGUE2_CLK2_P]
NetC46_1: P4.1(X) ; port EXTREFIN_125M
NetD5_2: J2.31 ; port EXT_NRST
NetIC1#1_A11: P2.5 ; port CPU_DEBUG_RXD
NetIC1#1_E10: P2.3 ; port CPU_DEBUG_TXD
NetIC1#1_K14: J2.29 ; port EXT_IRQ0
NetIC12_2: P8.1(X) ; port EXTPPSIN
NetIC26_1: J2.15 ; port FBOOT_SEL
NetP1_1: P1.1(X) ; port EXTREF125MHZOUT
NetP3_1: P3.1(X) ; port EXTPPSOUT
NetP7_1: P7.1(X) ; port EXTREFIN_10M
NetP7_2: P7.2(Y) ; port EXTREFIN_10M_RET

Not connected (* = marked no-connect by the designer): CN1 4 5 7 8; J2 5 7; P5 12* 14*; P6 17* 19*

### Buses and harness runs
bus FPGA_GPIO[0..39] = port FPGA_GPIO[0..39]
bus PC[0..15] = port PC[0..15]
bus PE[0..7] = port PE[0..7]

### Layout directives
differential pair: DMTDCLK_mB_N, DMTDCLK_mB_P, ETH_100MHz.RX_N, ETH_100MHz.RX_P, ETH_100MHz.TX_N, ETH_100MHz.TX_P, FPGA_GCLK_N, FPGA_GCLK_P, MGTRX112_0_N, MGTRX112_0_P, MGTRX112_1_N, MGTRX112_1_P, MGTRX112_2_N, MGTRX112_2_P, MGTRX112_3_N, MGTRX112_3_P, MGTRX113_0_N, MGTRX113_0_P, MGTRX113_1_N, MGTRX113_1_P, MGTRX113_2_N, MGTRX113_2_P, MGTRX113_3_N, MGTRX113_3_P, MGTRX114_0_N, MGTRX114_0_P, MGTRX114_1_N, MGTRX114_1_P, MGTRX114_2_N, MGTRX114_2_P, MGTRX114_3_N, MGTRX114_3_P, MGTRX115_0_N, MGTRX115_0_P, MGTRX115_1_N, MGTRX115_1_P, MGTRX115_2_N, MGTRX115_2_P, MGTRX115_3_N, MGTRX115_3_P, MGTRX116_0_N, MGTRX116_0_P, MGTRX116_1_N, MGTRX116_1_P, MGTRX116_2_N, MGTRX116_2_P, MGTRX116_3_N, MGTRX116_3_P, MGTTX112_0_N, MGTTX112_0_P, MGTTX112_1_N, MGTTX112_1_P, MGTTX112_2_N, MGTTX112_2_P, MGTTX112_3_N, MGTTX112_3_P, MGTTX113_0_N, MGTTX113_0_P, MGTTX113_1_N, MGTTX113_1_P, MGTTX113_2_N, MGTTX113_2_P, MGTTX113_3_N, MGTTX113_3_P, MGTTX114_0_N, MGTTX114_0_P, MGTTX114_1_N, MGTTX114_1_P, MGTTX114_2_N, MGTTX114_2_P, MGTTX114_3_N, MGTTX114_3_P, MGTTX115_0_N, MGTTX115_0_P, MGTTX115_1_N, MGTTX115_1_P, MGTTX115_2_N, MGTTX115_2_P, MGTTX115_3_N, MGTTX115_3_P, MGTTX116_0_N, MGTTX116_0_P, MGTTX116_1_N, MGTTX116_1_P, MGTTX116_2_N, MGTTX116_2_P, MGTTX116_3_N, MGTTX116_3_P, uTCA_CLK.uTCA_TONGUE2_CLK1_N, uTCA_CLK.uTCA_TONGUE2_CLK1_P, uTCA_CLK.uTCA_TONGUE2_CLK2_N, uTCA_CLK.uTCA_TONGUE2_CLK2_P

### Notes on the sheet
- (in symbol CON_ETHERNET_TYCO_1888250-1) RJ45; left; right

### Library data of the parts
CN1 = CON_ETHERNET_TYCO_1888250-1: low profile uTCA Ethernet jack (RJ45); RefId: Mouser/571-1888250-1; Value: 1888250-1; Distributor1 PN: A98526-ND; Distributor1: Digikey
CN2 = KX15_20p: multipin B2B connector (plug); Supplier: Digikey; Value: KX15-20K4DE; Supplier PN: 670-1305-ND
CON1 = CON_USB_B: USB Receptacle Type B Right Angle; Value: 292304-1; Distributor1 PN: A31725-ND; Distributor1: Digikey
J4 = PWR_JACK: Power Jack 5A @ 12V; LEVEL: STD; PKG_TYPE: PWR_JACK; Value: DC10A; Distributor1 PN: 224959; Distributor1: Farnell
P1 P3 P4 P7 P8 = SMB: SMB Straight Connector; Value: 152123; LatestRevisionDate: 17-Jul-2002; LatestRevisionNote: Re-released for DXP Platform.; Publisher: Altium Limited; Distributor1 PN: ACX1509-ND; Distributor1: Digikey
P2 = MHDR2X3: Header, 3-Pin, Dual row, 2.54mm pitch; Manufacturer1: FCI; Value: 75869-131LF; LatestRevisionDate: 17-Jul-2002; LatestRevisionNote: Re-released for DXP Platform.; Publisher: Altium Limited; Distributor1: Digikey; Distributor1 PN: 609-2845-ND
P5 = Header 7X2: Header, 7-Pin, Dual row, 2.0 mm pitch; Value: SBH21-NBPN-D07-SM-BK; LatestRevisionDate: 17-Jul-2002; LatestRevisionNote: Re-released for DXP Platform.; Publisher: Altium Limited; Distributor1 PN: S9037-ND; Distributor1: Digikey
P6 = Header 10X2: Header, 10-Pin, Dual row, 2.54mm pitch; Manufacturer: Sullis Connectors; Value: SBH11-PBPC-D10-ST-BK; LatestRevisionDate: 17-Jul-2002; LatestRevisionNote: Re-released for DXP Platform.; Publisher: Altium Limited; Distributor1 PN: S9172-ND; Distributor1: Digikey

## Sheet CPU_JTAG_Power_PLL.SchDoc
size A4 portrait
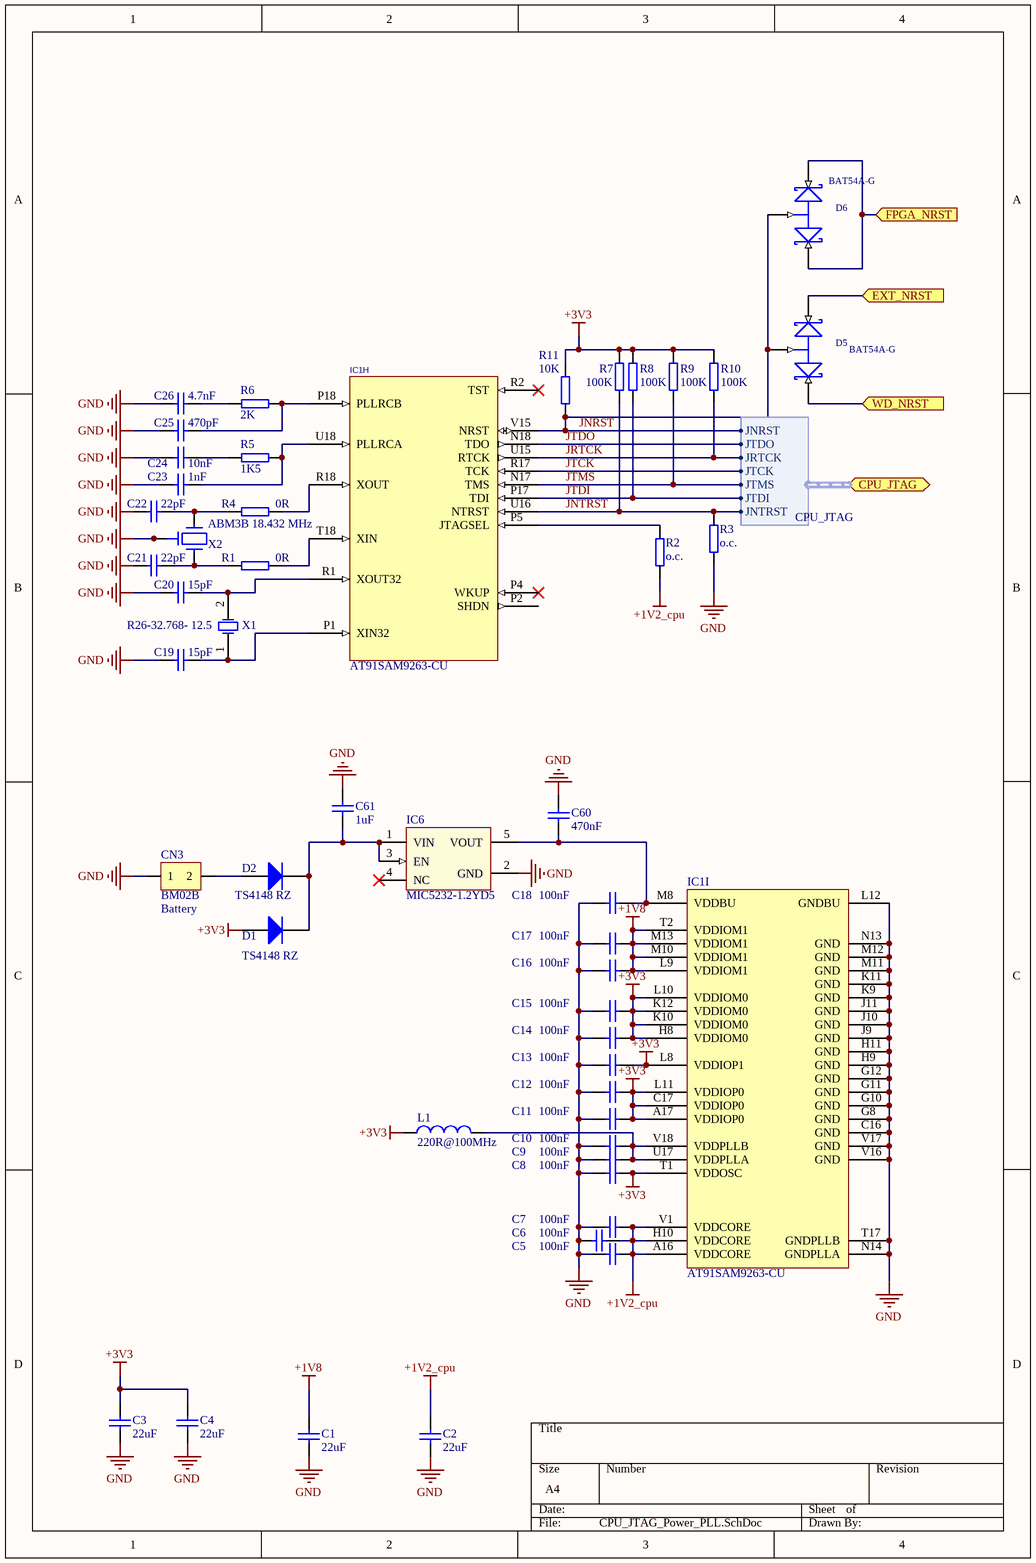
[diagram p2: CPU_JTAG_Power_PLL.SchDoc]

### Parts
(Parts that share a designator on the sheet are numbered #1, #2 ... from top to bottom, then left to right.)
C1  22uF  [CC2012-0805]
C2  22uF  [CC2012-0805]
C3  22uF  [CC2012-0805]
C4  22uF  [CC2012-0805]
C5  100nF  [CC1005-0402]
C6  100nF  [CC1005-0402]
C7  100nF  [CC1005-0402]
C8  100nF  [CC1005-0402]
C9  100nF  [CC1005-0402]
C10  100nF  [CC1005-0402]
C11  100nF  [CC1005-0402]
C12  100nF  [CC1005-0402]
C13  100nF  [CC1005-0402]
C14  100nF  [CC1005-0402]
C15  100nF  [CC1005-0402]
C16  100nF  [CC1005-0402]
C17  100nF  [CC1005-0402]
C18  100nF  [CC1005-0402]
C19  15pF  [CC1005-0402]
C20  15pF  [CC1005-0402]
C21  22pF  [CC1005-0402]
C22  22pF  [CC1005-0402]
C23  1nF  [CC1005-0402]
C24  10nF  [CC1005-0402]
C25  470pF  [CC1005-0402]
C26  4.7nF  [CC1005-0402]
C60  470nF  [CC1005-0402]
C61  1uF  [CC1005-0402]
CN3  BM02B  Comment2: Battery  [SH_CRIMP_1MM_2]
D1  TS4148 RZ  [CC1608-0603]
D2  TS4148 RZ  [CC1608-0603]
D5  BAT54A-G  [SOT23]
D6  BAT54A-G  [SOT23]
IC1#1  AT91SAM9263-CU  [TFBGA324]  (part H of 12)
IC1#2  AT91SAM9263-CU  [TFBGA324]  (part I of 9)
IC6  MIC5232-1.2YD5  [SOT23-5AL]
L1  Impedance: 220R@100MHz  [0603]  (hidden comment: 220R@100MHz Ferrite Bead)
R1  value 0R  [0402]  (hidden comment: Jumper)
R2  o.c.  [0402]
R3  o.c.  [0402]
R4  value 0R  [0402]  (hidden comment: Jumper)
R5  1K5  [0402]
R6  2K  [0402]
R7  100K  [0402]
R8  100K  [0402]
R9  100K  [0402]
R10  100K  [0402]
R11  10k  [0402]
X1  R26-32.768- 12.5  [XTAL_32k]
X2  ABM3B 18.432 MHz  [XTALL_ABM3]

### Ports
CPU_JTAG (harness CPU_JTAG), EXT_NRST (in), FPGA_NRST (in), WD_NRST (in)

### Harnesses
CPU_JTAG: JNRST, JTDO, JRTCK, JTCK, JTMS, JTDI, JNTRST

### Nets
+1V2_cpu: C2.2 C5.1 C6.1 C7.1 IC1#2.A16(VDDCORE) IC1#2.H10(VDDCORE) IC1#2.V1(VDDCORE) R2.2
+1V8: C1.2 C16.1 C17.1 IC1#2.L9(VDDIOM1) IC1#2.M10(VDDIOM1) IC1#2.M13(VDDIOM1) IC1#2.T2(VDDIOM1)
+3V3: C3.2 C4.2 C8.1 C11.1 C12.1 C13.1 C14.1 C15.1 D1.1(A) IC1#2.A17(VDDIOP0) IC1#2.C17(VDDIOP0) IC1#2.H8(VDDIOM0) IC1#2.K10(VDDIOM0) IC1#2.K12(VDDIOM0) IC1#2.L8(VDDIOP1) IC1#2.L10(VDDIOM0) IC1#2.L11(VDDIOP0) IC1#2.T1(VDDOSC) L1.1 R7.2 R8.2 R9.2 R10.2 R11.2
GND: C1.1 C2.1 C3.1 C4.1 C5.2 C6.2 C7.2 C8.2 C9.2 C10.2 C11.2 C12.2 C13.2 C14.2 C15.2 C16.2 C17.2 C18.2 C19.1 C20.1 C21.1 C22.1 C23.1 C24.2 C25.1 C26.1 C60.1 C61.1 CN3.1 IC1#2.C16(GND) IC1#2.G8(GND) IC1#2.G10(GND) IC1#2.G11(GND) IC1#2.G12(GND) IC1#2.H9(GND) IC1#2.H11(GND) IC1#2.J9(GND) IC1#2.J10(GND) IC1#2.J11(GND) IC1#2.K9(GND) IC1#2.K11(GND) IC1#2.L12(GNDBU) IC1#2.M11(GND) IC1#2.M12(GND) IC1#2.N13(GND) IC1#2.N14(GNDPLLA) IC1#2.T17(GNDPLLB) IC1#2.V16(GND) IC1#2.V17(GND) IC6.2(GND) R3.2 X2.2 X2.4
ARM_NRST: D6.1(K1) D6.2(K2) ; port FPGA_NRST
ARM_WD_RST: D5.1(K1) ; port WD_NRST
JNRST: D5.3(A) D6.3(A) IC1#1.V15(NRST) R11.1 ; port CPU_JTAG.JNRST  [project net CPU_JTAG.JNRST]
JNTRST: IC1#1.U16(NTRST) R3.1 R7.1 ; port CPU_JTAG.JNTRST  [project net CPU_JTAG.JNTRST]
JRTCK: IC1#1.U15(RTCK) R10.1 ; port CPU_JTAG.JRTCK  [project net CPU_JTAG.JRTCK]
JTCK: IC1#1.R17(TCK) ; port CPU_JTAG.JTCK  [project net CPU_JTAG.JTCK]
JTDI: IC1#1.P17(TDI) R8.1 ; port CPU_JTAG.JTDI  [project net CPU_JTAG.JTDI]
JTDO: IC1#1.N18(TDO) ; port CPU_JTAG.JTDO  [project net CPU_JTAG.JTDO]
JTMS: IC1#1.N17(TMS) R9.1 ; port CPU_JTAG.JTMS  [project net CPU_JTAG.JTMS]
NetC9_1: C9.1 C10.1 IC1#2.U17(VDDPLLA) IC1#2.V18(VDDPLLB) L1.2
NetC18_1: C18.1 C60.2 IC1#2.M8(VDDBU) IC6.5(VOUT)
NetC19_2: C19.2 IC1#1.P1(XIN32) X1.1(OSC1)
NetC20_2: C20.2 IC1#1.R1(XOUT32) X1.2(OSC2)
NetC21_2: C21.2 R1.1 X2.3
NetC22_2: C22.2 R4.1 X2.1
NetC23_2: C23.2 IC1#1.U18(PLLRCA) R5.1
NetC24_1: C24.1 R5.2
NetC25_2: C25.2 IC1#1.P18(PLLRCB) R6.2
NetC26_2: C26.2 R6.1
NetC61_2: C61.2 D1.2(K) D2.2(K) IC6.1(VIN) IC6.3(EN)
NetCN3_2: CN3.2 D2.1(A)
NetD5_2: D5.2(K2) ; port EXT_NRST
NetIC1#1_P5: IC1#1.P5(JTAGSEL) R2.1
NetIC1#1_R18: IC1#1.R18(XOUT) R4.2
NetIC1#1_T18: IC1#1.T18(XIN) R1.2

Not connected (* = marked no-connect by the designer): IC1#1 P2(SHDN) P4(WKUP)* R2(TST)*; IC6 4(NC)*

### Library data of the parts
C1-C4 = CC0805_22UF_6.3V_20%_X5R: Capacitor; Manufacturer1: TDK; Manufacturer1 PN: C2012X5R0J226M; TC: X5R; Tolerance: ±20%; Voltage: 6.3V; Published: 8-Jun-2000; LatestRevisionDate: 17-Jul-2002; LatestRevisionNote: Re-released for DXP Platform.; PackageReference: RAD-0.3; Publisher: Altium Limited; Distributor1: Digikey; Distributor1 PN: 445-1422-1-ND; Case: 0805; Value: 22uF
C5-C18 = CC0402_100NF_16V_10%_X7R: Capacitor; Manufacturer1: TDK; Manufacturer1 PN: C1005X7R1C104K; TC: X7R; Tolerance: ±10%; Voltage: 16V; Published: 8-Jun-2000; LatestRevisionDate: 17-Jul-2002; LatestRevisionNote: Re-released for DXP Platform.; PackageReference: RAD-0.3; Publisher: Altium Limited; Distributor1: Digikey; Distributor1 PN: 445-4952-1-ND; Case: 0402; Value: 100nF
C19 C20 = CC0402_15PF_50V_5%_NP0: Capacitor; Manufacturer1: TDK; Manufacturer1 PN: C1005C0G1H150J; TC: NP0; Tolerance: ±5%; Voltage: 50V; Published: 8-Jun-2000; LatestRevisionDate: 17-Jul-2002; LatestRevisionNote: Re-released for DXP Platform.; PackageReference: RAD-0.3; Publisher: Altium Limited; Distributor1: Digikey; Distributor1 PN: 445-1237-1-ND; Case: 0402; Value: 15pF
C21 C22 = CC0402_22PF_50V_5%_NP0: Capacitor; Manufacturer1: TDK; Manufacturer1 PN: C1005C0G1H220J; TC: NP0; Tolerance: ±5%; Voltage: 50V; Published: 8-Jun-2000; LatestRevisionDate: 17-Jul-2002; LatestRevisionNote: Re-released for DXP Platform.; PackageReference: RAD-0.3; Publisher: Altium Limited; Distributor1: Digikey; Distributor1 PN: 445-1239-1-ND; Case: 0402; Value: 22pF
C23 = CC0402_1NF_25V_10%_X7R: Capacitor; Manufacturer1: TDK; Manufacturer1 PN: C1005X7R1E102K; TC: X7R; Tolerance: ±10%; Voltage: 25V; Published: 8-Jun-2000; LatestRevisionDate: 17-Jul-2002; LatestRevisionNote: Re-released for DXP Platform.; PackageReference: RAD-0.3; Publisher: Altium Limited; Distributor1: Digikey; Distributor1 PN: 445-4924-1-ND; Case: 0402; Value: 1nF
C24 = CC0402_10NF_25V_10%_X7R: Capacitor; Manufacturer1: TDK; Manufacturer1 PN: C1005X7R1E103K; TC: X7R; Tolerance: ±10%; Voltage: 25V; Published: 8-Jun-2000; LatestRevisionDate: 17-Jul-2002; LatestRevisionNote: Re-released for DXP Platform.; PackageReference: RAD-0.3; Publisher: Altium Limited; Distributor1: Digikey; Distributor1 PN: 445-1260-1-ND; Case: 0402; Value: 10nF
C25 = CC0402_470PF_50V_10%_X7R: Capacitor; Manufacturer1: TDK; Manufacturer1 PN: C1005X7R1H471K; TC: X7R; Tolerance: ±10%; Voltage: 50V; Published: 8-Jun-2000; LatestRevisionDate: 17-Jul-2002; LatestRevisionNote: Re-released for DXP Platform.; PackageReference: RAD-0.3; Publisher: Altium Limited; Distributor1: Digikey; Distributor1 PN: 445-1255-1-ND; Case: 0402; Value: 470pF
C26 = CC0402_4.7NF_25V_10%_X7R: Capacitor; Manufacturer1: TDK; Manufacturer1 PN: C1005X7R1E472K; TC: X7R; Tolerance: ±10%; Voltage: 25V; Published: 8-Jun-2000; LatestRevisionDate: 17-Jul-2002; LatestRevisionNote: Re-released for DXP Platform.; PackageReference: RAD-0.3; Publisher: Altium Limited; Distributor1: Digikey; Distributor1 PN: 445-1259-1-ND; Case: 0402; Value: 4.7nF
C60 = CC0402_470NF_16V_10%_X5R: Capacitor; Manufacturer1: TDK; Manufacturer1 PN: C1005X5R1C474K; TC: X5R; Tolerance: ±10%; Voltage: 16V; Published: 8-Jun-2000; LatestRevisionDate: 17-Jul-2002; LatestRevisionNote: Re-released for DXP Platform.; PackageReference: RAD-0.3; Publisher: Altium Limited; Distributor1: Digikey; Distributor1 PN: 445-4976-1-ND; Case: 0402; Value: 470nF
C61 = CC0402_1UF_16V_10%_X5R: Capacitor; Manufacturer1: TDK; Manufacturer1 PN: C1005X5R1C105K; TC: X5R; Tolerance: ±10%; Voltage: 16V; Published: 8-Jun-2000; LatestRevisionDate: 17-Jul-2002; LatestRevisionNote: Re-released for DXP Platform.; PackageReference: RAD-0.3; Publisher: Altium Limited; Distributor1: Digikey; Distributor1 PN: 445-4978-1-ND; Case: 0402; Value: 1uF
CN3 = CON_SH_CRIMP_1MM_2: RefId: Far/1679127
D1 D2 = Diode: Default Diode; Published: 8-Jun-2000; LatestRevisionDate: 17-Jul-2002; LatestRevisionNote: Re-released for DXP Platform.; PackageDocument: Sep-1996; PackageReference: SMC; Publisher: Altium Limited; Code_JEDEC: DO-214-AB; Value: TS4148 RZ; Distributor1 PN: 8150192; Distributor1: Farnell
D5 D6 = BAT54A.1: Schottky Barrier Double Diode; PACKAGE_INFORMATION: Latest Revision: May-1999; DEVICE: BAT54A-G; PKG_TYPE: SOT23; PUBLISHED: 17-Sep-2003; DATASHEET: Latest Revision: 4-Mar-2002; PACKAGE_REFERENCE: SOT23; PUBLISHER: Altium Limited; Value: BAT54A-G; Distributor1 PN: 641-1319-1-ND; Distributor1: Digikey
IC1#1 IC1#2 = AT91SAM9263: Atmel ARM926 MCU; Supplier: EBV; RefId: AT91SAM9263-CU; Value: AT91SAM9263-CU
IC6 = MIC5232-1.2YD5: 10mA Ultra-Low Quiescent Current uCap LDO; Manufacturer: Micrel; Value: MIC5232-1.2YD5; Distributor1: Digikey; Distributor1 PN: 576-1829-1-ND
L1 = L_FERRITE_BEAD: ferrite bead; Manufacturer1: Murata; Manufacturer1 PN: BLM18KG221SN1D; Current Rating: 2.2A; DCR: 50mOhm; Case: 0603; Distributor1: Digikey; Distributor1 PN: 490-5255-1-ND
R1 R4 = R0402_0R_0.1W_JUMPER: SMD Resistor; Manufacturer1: Panasonic; Manufacturer1 PN: ERJ-2GE0R00X; TCR: 100ppm; Power Rating: 0.1W; Case: 0402; Distributor1: DigiKey; Distributor1 PN: P0.0JCT-ND; Tolerance: Jumper
R2 R3 = R0402_O.C.: SMD Resistor; Case: 0402; Manufacturer1: N/A; Manufacturer1 PN: N/A; Distributor1: N/A; Distributor1 PN: N/A; TCR: N/A; Power Rating: N/A; Tolerance: N/A; Value: o.c.
R5 = R0402_1K5_±1%_0.1W_100PPM: SMD Resistor; Manufacturer1: Panasonic; Manufacturer1 PN: ERJ-2RKF1501X; TCR: 100ppm; Power Rating: 0.1W; Tolerance: ±1%; Case: 0402; Distributor1: DigiKey; Distributor1 PN: P1.50KLCT-ND; Value: 1K5
R6 = R0402_2K_±1%_0.1W_100PPM: SMD Resistor; Manufacturer1: Panasonic; Manufacturer1 PN: ERJ-2RKF2001X; TCR: 100ppm; Power Rating: 0.1W; Tolerance: ±1%; Case: 0402; Distributor1: DigiKey; Distributor1 PN: P2.00KLCT-ND; Value: 2K
R7-R10 = R0402_100K_±1%_0.1W_100PPM: SMD Resistor; Manufacturer1: Panasonic; Manufacturer1 PN: ERJ-2RKF1003X; TCR: 100ppm; Power Rating: 0.1W; Tolerance: ±1%; Case: 0402; Distributor1: DigiKey; Distributor1 PN: P100KLCT-ND; Value: 100K
R11 = R0402_10K_±1%_0.1W_100PPM: SMD Resistor; Manufacturer1: Panasonic; Manufacturer1 PN: ERJ-2RKF1002X; TCR: 100ppm; Power Rating: 0.1W; Tolerance: ±1%; Case: 0402; Distributor1: DigiKey; Distributor1 PN: P10.0KLCT-ND; Value: 10K
X1 = XTAL: Crystal Oscillator; Manufacturer: Raltron; Published: 8-Jun-2000; LatestRevisionDate: 17-Jul-2002; LatestRevisionNote: Re-released for DXP Platform.; PackageReference: R38; Publisher: Altium Limited; Value: R26-32.768- 12.5; Distributor1: Farnell; Distributor1 PN: 1652573
X2 = X_CRYSTAL_SMD_ABM8: Miniature crystal oscillator (ABRACON); Value: ABM3B-18.432MHZ-B2-T; RefId: 1611814; Supplier: Farnell

## Sheet RS232_and_USB_ports.SchDoc
size A portrait
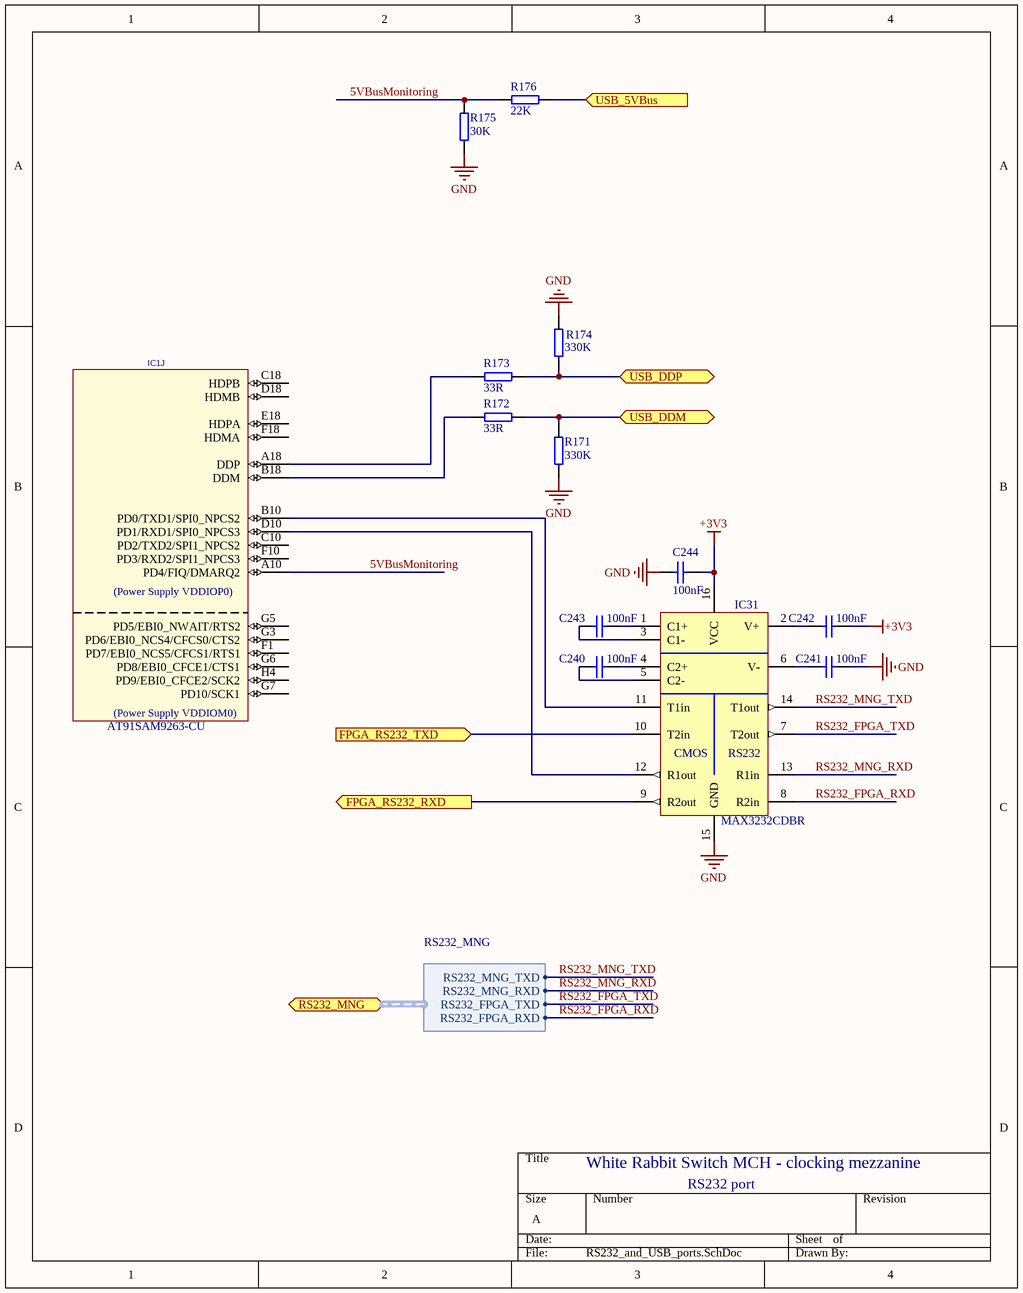
[diagram p3: RS232_and_USB_ports.SchDoc]

### Parts
(Parts that share a designator on the sheet are numbered #1, #2 ... from top to bottom, then left to right.)
C240  100nF  [CC1005-0402]
C241  100nF  [CC1005-0402]
C242  100nF  [CC1005-0402]
C243  100nF  [CC1005-0402]
C244  100nF  [CC1005-0402]
IC1#1  AT91SAM9263-CU  [TFBGA324]  (part J of 12)
IC31  MAX3232CDBR  [SSOP16]
R171  330K  [0402]
R172  33R  [0603]
R173  33R  [0603]
R174  330K  [0402]
R175  30K  [0402]
R176  22K  [0402]

### Ports
FPGA_RS232_RXD (out), FPGA_RS232_TXD (in), RS232_MNG (harness RS232_MNG), USB_5VBus (in), USB_DDM (bidir), USB_DDP (bidir)

### Harnesses
RS232_MNG: RS232_MNG_TXD, RS232_FPGA_TXD, RS232_MNG_RXD, RS232_FPGA_RXD

### Nets
+3V3: C242.1 C244.1 IC31.16(VCC)
GND: C241.1 C244.2 IC31.15(GND) R171.1 R174.2 R175.1
5VBusMonitoring: IC1#1.A10(PD4/FIQ/DMARQ2) R175.2 R176.2
FPGA_RS232_RXD: IC31.9(R2out) ; port FPGA_RS232_RXD
FPGA_RS232_TXD: IC31.10(T2in) ; port FPGA_RS232_TXD
RS232_FPGA_RXD: IC31.8(R2in) ; port RS232_MNG.RS232_FPGA_RXD
RS232_FPGA_TXD: IC31.7(T2out) ; port RS232_MNG.RS232_FPGA_TXD
RS232_MNG_RXD: IC31.13(R1in) ; port RS232_MNG.RS232_MNG_RXD  [project net RS232_MNG.RS232_MNG_RXD]
RS232_MNG_TXD: IC31.14(T1out) ; port RS232_MNG.RS232_MNG_TXD  [project net RS232_MNG.RS232_MNG_TXD]
USB_5VBus: R176.1 ; port USB_5VBus
USB_DDM: R171.2 R172.2 ; port USB_DDM
USB_DDP: R173.2 R174.1 ; port USB_DDP
NetC240_1: C240.1 IC31.4(C2+)
NetC240_2: C240.2 IC31.5(C2-)
NetC241_2: C241.2 IC31.6(V-)
NetC242_2: C242.2 IC31.2(V+)
NetC243_1: C243.1 IC31.1(C1+)
NetC243_2: C243.2 IC31.3(C1-)
NetIC1#1_A18: IC1#1.A18(DDP) R173.1
NetIC1#1_B10: IC1#1.B10(PD0/TXD1/SPI0_NPCS2) IC31.11(T1in)
NetIC1#1_B18: IC1#1.B18(DDM) R172.1
NetIC1#1_D10: IC1#1.D10(PD1/RXD1/SPI0_NPCS3) IC31.12(R1out)

Not connected (* = marked no-connect by the designer): IC1#1 C10(PD2/TXD2/SPI1_NPCS2) C18(HDPB) D18(HDMB) E18(HDPA) F1(PD7/EBI0_NCS5/CFCS1/RTS1) F10(PD3/RXD2/SPI1_NPCS3) F18(HDMA) G3(PD6/EBI0_NCS4/CFCS0/CTS2) G5(PD5/EBI0_NWAIT/RTS2) G6(PD8/EBI0_CFCE1/CTS1) G7(PD10/SCK1) H4(PD9/EBI0_CFCE2/SCK2)

### Notes on the sheet
- White Rabbit Switch MCH - clocking mezzanine
- RS232 port
- (in symbol AT91SAM9263, part J) (Power Supply VDDIOP0); (Power Supply VDDIOM0)
- (in symbol IFC_MAX3232) CMOS; RS232

### Library data of the parts
C240-C244 = CC0402_100NF_16V_10%_X7R: as C5 on sheet CPU_JTAG_Power_PLL; Published: 8-Jun-2000; LatestRevisionDate: 17-Jul-2002; LatestRevisionNote: Re-released for DXP Platform.; PackageReference: RAD-0.3; Publisher: Altium Limited; Distributor1: Digikey; Distributor1 PN: 445-4952-1-ND; Case: 0402; Value: 100nF
IC1#1 = AT91SAM9263: Atmel ARM926 MCU; Supplier: EBV; RefId: AT91SAM9263-CU; Value: AT91SAM9263-CU
IC31 = IFC_MAX3232: RefId: 1575483; Supplier: Farnell; Value: MAX3232CDBR
R171 R174 = R0402_330K_±1%_0.1W_100PPM: SMD Resistor; Manufacturer1: Panasonic; Manufacturer1 PN: ERJ-2RKF3303X; TCR: 100ppm; Power Rating: 0.1W; Tolerance: ±1%; Case: 0402; Distributor1: DigiKey; Distributor1 PN: P330KLCT-ND; Value: 330K
R172 R173 = R0603_33R_±1%_0.25W_100PPM: SMD Resistor; Manufacturer1: Vishay/Dale; Manufacturer1 PN: CRCW060333R0FKEAHP; TCR: 100ppm; Power Rating: 0.25W; Tolerance: ±1%; Case: 0402; Distributor1: DigiKey; Distributor1 PN: 541-33.0SCT-ND; Value: 33R
R175 = R0402_30K_±1%_0.1W_100PPM: SMD Resistor; Manufacturer1: Panasonic; Manufacturer1 PN: ERJ-2RKF3002X; TCR: 100ppm; Power Rating: 0.1W; Tolerance: ±1%; Case: 0402; Distributor1: DigiKey; Distributor1 PN: P30.0KLCT-ND; Value: 30K
R176 = R0402_22K_±1%_0.1W_100PPM: SMD Resistor; Manufacturer1: Panasonic; Manufacturer1 PN: ERJ-2RKF2202X; TCR: 100ppm; Power Rating: 0.1W; Tolerance: ±1%; Case: 0402; Distributor1: DigiKey; Distributor1 PN: P22.0KLCT-ND; Value: 22K